# EAGLE schematic Split12VoltForTesting (EAGLE 6.5.0)
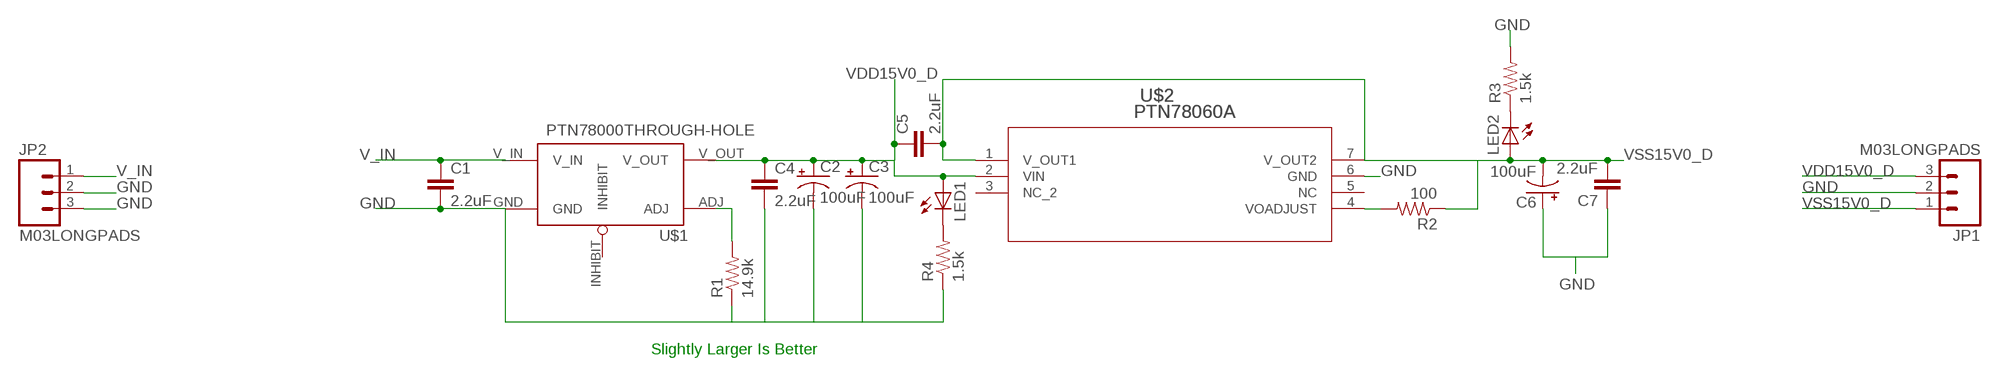
[diagram p0: schematic, sheet 1]

## Parts
C1  2.2uF  CAP1210  [1210]
C2  100uF  CAP_POLPTH1  [CPOL-RADIAL-100UF-25V]
C3  100uF  CAP_POLPTH1  [CPOL-RADIAL-100UF-25V]
C4  2.2uF  CAP1210  [1210]
C5  2.2uF  CAP1210  [1210]
C6  100uF  CAP_POLPTH1  [CPOL-RADIAL-100UF-25V]
C7  2.2uF  CAP1210  [1210]
JP1  M03LONGPADS  [1X03_LONGPADS]
JP2  M03LONGPADS  [1X03_LONGPADS]
LED1  LED0805  [LED-0805]
LED2  LED0805  [LED-0805]
R1  14.9k  RESISTOR0805-RES  [0805]
R2  100  RESISTOR0805-RES  [0805]
R3  1.5k  RESISTOR0805-RES  [0805]
R4  1.5k  RESISTOR0805-RES  [0805]
U$1  PTN78000THROUGH-HOLE  [PTN78000]
U$2  PTN78060A  [PTN_EUW]

## Nets
GND: C1.2 C2.2(-) C3.2(-) C4.2 C6.1(+) C7.1 JP1.2 JP2.2 JP2.3 R1.1 R3.2 R4.1 U$1.GND U$2.6(GND)
N$1: LED2.2(C) R3.1
N$2: R2.2 U$2.4(VOADJUST)
N$3: R1.2 U$1.ADJ
N$4: LED1.2(C) R4.2
V_IN: C1.1 JP2.1 U$1.V_IN
VDD15V0_D: C2.1(+) C3.1(+) C4.1 C5.1 JP1.3 LED1.1(A) U$1.V_OUT U$2.2(VIN)
VSS15V0_D: C5.2 C6.2(-) C7.2 JP1.1 LED2.1(A) R2.1 U$2.1(V_OUT1) U$2.7(V_OUT2)
Unconnected: U$1.INHIBIT U$2.3(NC_2) U$2.5(NC)

## Notes on the sheet
- Slightly Larger Is Better

## Library data of the parts
C1 C4 C5 C7 = SensorCape:CAP: Capacitor Standard 0603 ceramic capacitor, and 0.1" leaded capacitor.
C2 C3 C6 = SensorCape:CAP_POL: Capacitor Polarized These are standard SMD and PTH capacitors. Normally 10uF, 47uF, and 100uF in electrolytic and tantalum varieties. Always verify the external diameter of the through hole cap, it varies with capacity, voltage, and manufacturer. The EIA devices should be standard.
JP1 JP2 = SensorCape:M03: Header 3 Standard 3-pin 0.1" header. Use with straight break away headers (SKU : PRT-00116), right angle break away headers (PRT-00553), swiss pins (PRT-00743), machine pins (PRT-00117), and female headers (PRT-00115). Molex polarized connector foot print use with SKU : PRT-08232 with associated crimp pins and housings.
LED1 LED2 = SensorCape:LED: LEDs Standard schematic elements and footprints for 5mm, 3mm, 1206, and 0603 sized LEDs. 5mm - Spark Fun Electronics SKU : COM-00529 (and others)
R1-R4 = SensorCape:RESISTOR: Resistor Basic schematic elements and footprints for 0603, 1206, and PTH resistors.
U$1 = SensorCape:PTN78000: This is the PTN78000 part by Texas Instruments. It's a 1.5A adjustable switching regulator.
U$2 = SensorCape:PTN78060A